# EAGLE design Akkucheck (EAGLE 5.11)
MF: AVAGO TECHNOLOGIES; MPN: ACPL-217-500E; OC_FARNELL: 1602614
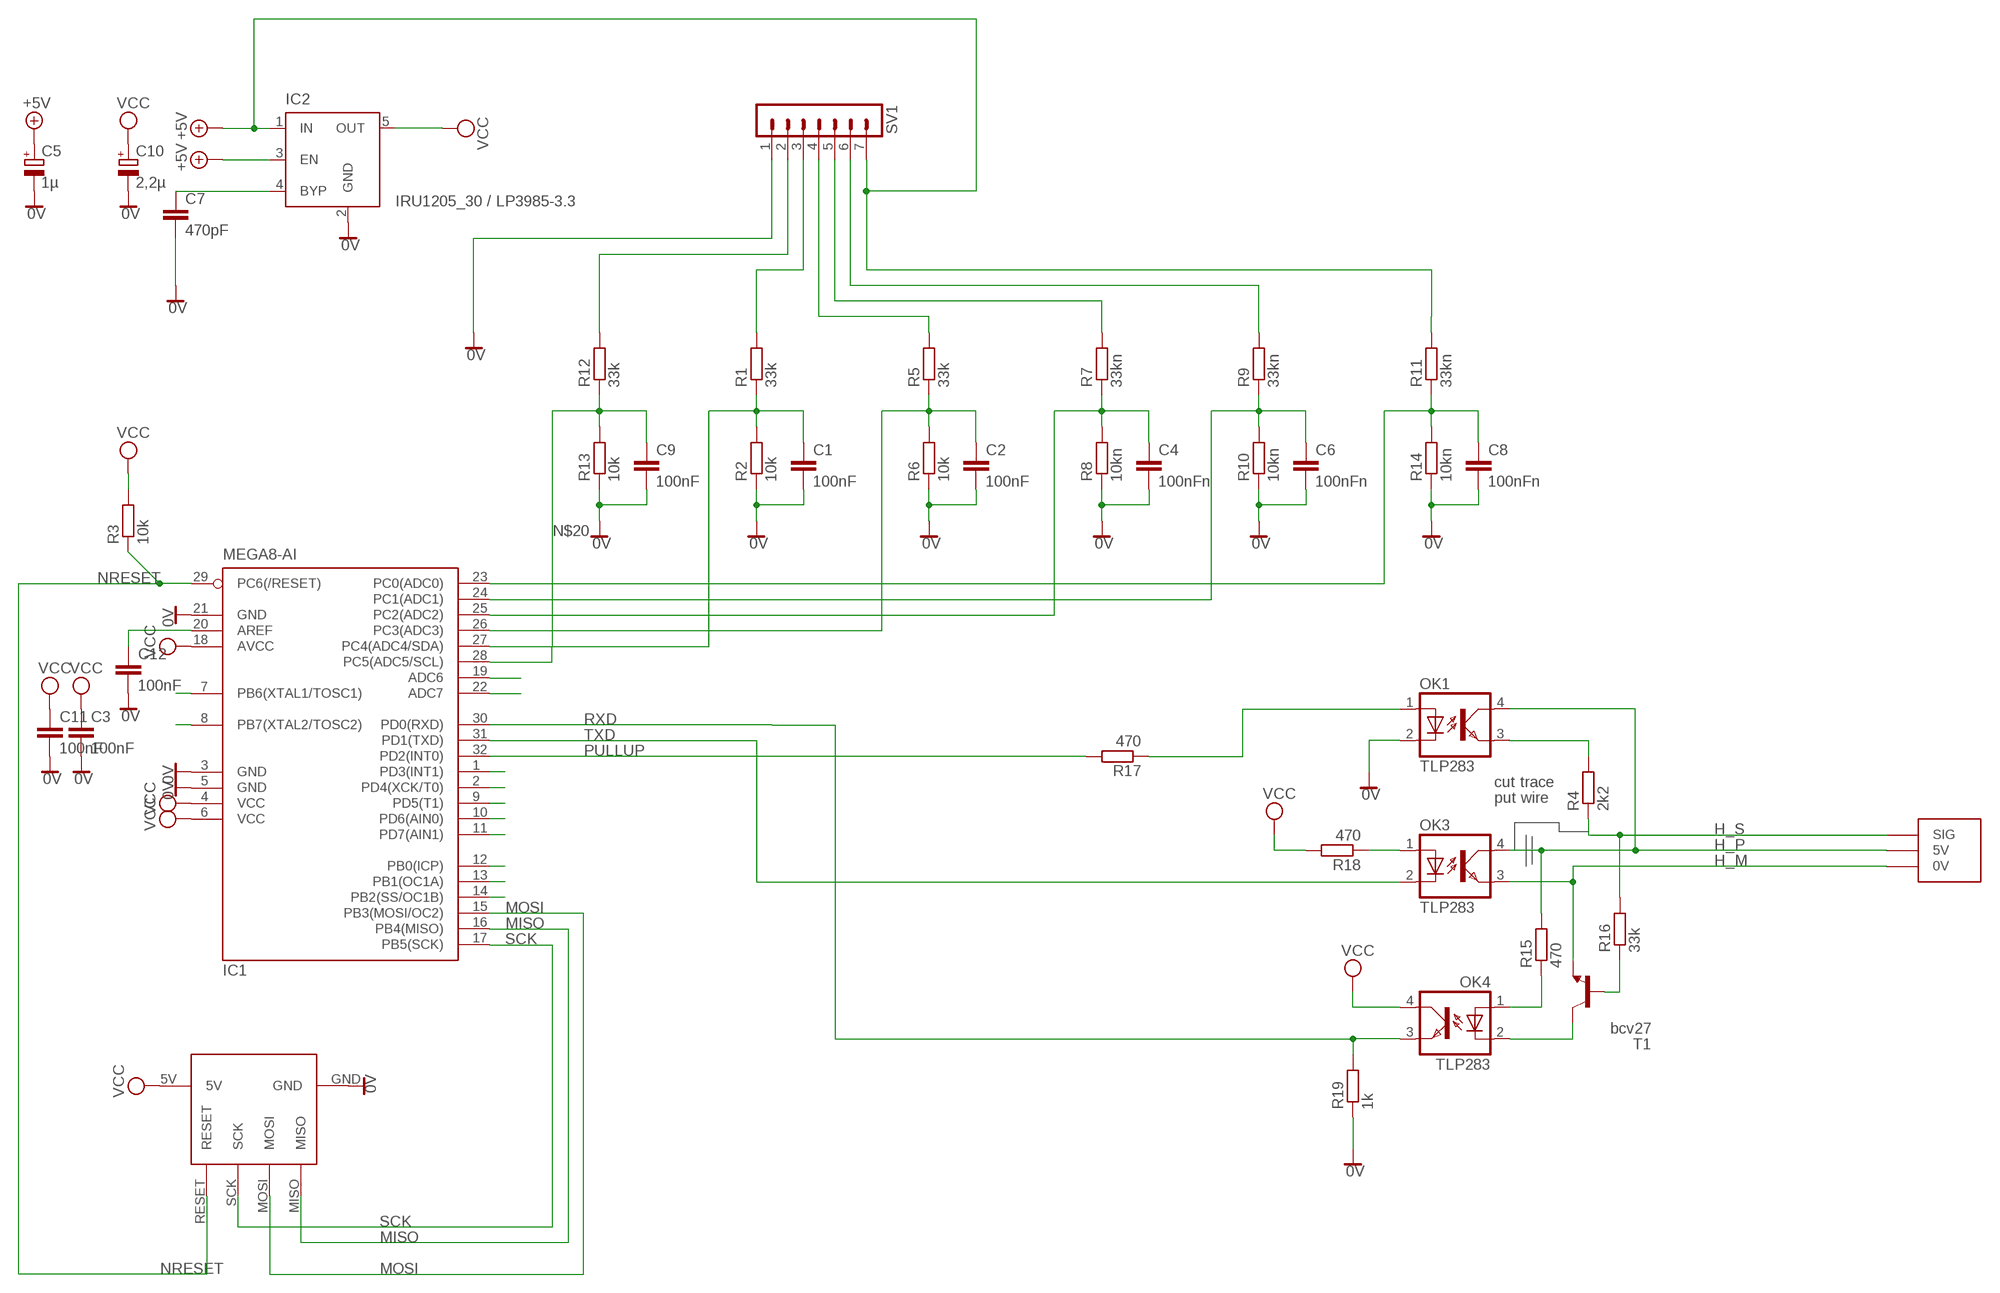
[diagram p0: schematic, sheet 1]

## Parts
C1  100nF  C-EUC0603  [C0603]
C2  100nF  C-EUC0603  [C0603]
C3  100nF  C-EUC0603  [C0603]
C4  100nFn  C-EUC0603  [C0603]
C5  1µ  CPOL-EUA/3216-18R  [A/3216-18R]
C6  100nFn  C-EUC0603  [C0603]
C7  470pF  C-EUC0805  [C0805]
C8  100nFn  C-EUC0603  [C0603]
C9  100nF  C-EUC0603  [C0603]
C10  2,2µ  CPOL-EUB/3528-21R  [B/3528-21R]
C11  100nF  C-EUC0603K  [C0603K]
C12  100nF  C-EUC0603  [C0603]
IC1  MEGA8-AI  [TQFP32-08]
IC2  IRU1205_30 / LP3985-3.3  MIC5219XX  [SOT23-5]
IN3  3-WIRE_CONNWIRE  [3WIRE_CONN]
OK1  TLP283  [MINI-FLAT-4]
OK3  TLP283  [MINI-FLAT-4]
OK4  TLP283  [MINI-FLAT-4]
R1  33k  R-EU_R0603  [R0603]
R2  10k  R-EU_R0603  [R0603]
R3  10k  R-EU_R0603  [R0603]
R4  2k2  R-EU_R0603  [R0603]
R5  33k  R-EU_R0603  [R0603]
R6  10k  R-EU_R0603  [R0603]
R7  33kn  R-EU_R0603  [R0603]
R8  10kn  R-EU_R0603  [R0603]
R9  33kn  R-EU_R0603  [R0603]
R10  10kn  R-EU_R0603  [R0603]
R11  33kn  R-EU_R0603  [R0603]
R12  33k  R-EU_R0603  [R0603]
R13  10k  R-EU_R0603  [R0603]
R14  10kn  R-EU_R0603  [R0603]
R15  470  R-EU_R0603  [R0603]
R16  33k  R-EU_R0603  [R0603]
R17  470  R-EU_R0603  [R0603]
R18  470  R-EU_R0603  [R0603]
R19  1k  R-EU_R0603  [R0603]
SV1  MA07-1  [MA07-1]
T1  bcv27  BC817-16-NPN-SOT23-BEC  [SOT23-BEC]
U$1  ISPSMD  [ISP_SMD]

## Nets
0V: C1.2 C2.2 C3.2 C4.2 C5.- C6.2 C7.2 C8.2 C9.2 C10.- C11.2 C12.2 IC1.3(GND) IC1.5(GND) IC1.21(GND) IC2.2(GND) OK1.2(C) R2.1 R6.1 R8.1 R10.1 R13.1 R14.1 R19.1 SV1.1 U$1.GND
+5V [supp]: C5.+ IC2.1(IN) IC2.3(EN) R11.2 SV1.7
H_M [isol]: IN3.0V OK3.3(EMIT) T1.E
H_P [isol]: IN3.5V OK1.4(COL) OK3.4(COL) R15.2
H_S [isol]: IN3.SIG R4.1 R16.2
MISO: IC1.16(PB4(MISO)) U$1.MISO
MOSI: IC1.15(PB3(MOSI/OC2)) U$1.MOSI
N$1 [supp]: R12.2 SV1.2
N$2 [supp]: R1.2 SV1.3
N$3 [supp]: R5.2 SV1.4
N$4 [supp]: R7.2 SV1.5
N$5 [supp]: R9.2 SV1.6
N$6: IC1.19(ADC6)
N$7: IC1.22(ADC7)
N$8: C7.1 IC2.4(BYP)
N$9: IC1.1(PD3(INT1))
N$10: IC1.2(PD4(XCK/T0))
N$11 [isol]: OK1.3(EMIT) R4.2
N$12 [isol]: OK4.1(A) R15.1
N$13 [isol]: OK4.2(C) T1.C
N$14: C8.1 IC1.23(PC0(ADC0)) R11.1 R14.2
N$15: C1.1 IC1.27(PC4(ADC4/SDA)) R1.1 R2.2
N$16: C2.1 IC1.26(PC3(ADC3)) R5.1 R6.2
N$17: C4.1 IC1.25(PC2(ADC2)) R7.1 R8.2
N$18: IC1.9(PD5(T1))
N$19: IC1.10(PD6(AIN0))
N$20: C9.1 IC1.28(PC5(ADC5/SCL)) R12.1 R13.2
N$21: C6.1 IC1.24(PC1(ADC1)) R9.1 R10.2
N$22 [isol]: R16.1 T1.B
N$23: OK3.1(A) R18.1
N$24: IC1.11(PD7(AIN1))
N$25: OK1.1(A) R17.1
N$26: C12.1 IC1.20(AREF)
N$27: IC1.12(PB0(ICP))
N$28: IC1.13(PB1(OC1A))
N$29: IC1.14(PB2(SS/OC1B))
N$30: IC1.7(PB6(XTAL1/TOSC1))
N$31: IC1.8(PB7(XTAL2/TOSC2))
NRESET: IC1.29(PC6(/RESET)) R3.1 U$1.RESET
PULLUP: IC1.32(PD2(INT0)) R17.2
RXD: IC1.30(PD0(RXD)) OK4.3(EMIT) R19.2
SCK: IC1.17(PB5(SCK)) U$1.SCK
TXD: IC1.31(PD1(TXD)) OK3.2(C)
VCC: C3.1 C10.+ C11.1 IC1.4(VCC) IC1.6(VCC) IC1.18(AVCC) IC2.5(OUT) OK4.4(COL) R3.2 R18.2 U$1.5V

## Notes on the sheet
- cut trace
- put wire

## Library data of the parts
C1-C4 C6-C9 C11 C12 = rcl:C-EU: CAPACITOR, European symbol
C5 C10 = rcl:CPOL-EU: POLARIZED CAPACITOR, European symbol
IC1 = atmel:MEGA8: MICROCONTROLLER 8 Kbytes FLASH, 1 kbytes SRAM, 512 bytes EEPROM, USART, 6-channel 10 bit ADC, 2-channel 8 bit ADC Pin compatible with Atmega48, ATMega88, ATMega168 Source: avr.lbr; MPN: ATMEGA8-16AU; OC_FARNELL: 9171371; OC_NEWARK: 73M8863
IC2 = v-reg-micrel:MIC5219XX: VOLTAGE REGULATOR; OC_FARNELL: unknown; OC_NEWARK: unknown
IN3 = Fabi:3-WIRE_CONN
OK1 OK3 OK4 = optocoupler:TLP283: TOSHIBA PHOTOCOUPLER GaAs IRED & PHOTO-TRANSISTOR Source: http://www.semicon.toshiba.co.jp/td/en/Opto/Photocoupler/en_20050928_TLP283_datasheet.pdf; OC_FARNELL: unknown; OC_NEWARK: unknown
R1-R19 = rcl:R-EU_: RESISTOR, European symbol
SV1 = con-lstb:MA07-1: PIN HEADER; OC_FARNELL: unknown; OC_NEWARK: unknown
T1 = transistor:*-NPN-: NPN Transistror BF959 corrected 2008.03.06
U$1 = Fabi:ISP: ISP connector

## Net classes
0 default: width 0.15 mm
1 supp: width 0.25 mm
2 isol: width 0.15 mm, clearance 0.5 mm to class 0, clearance 0.5 mm to class 1

## Board
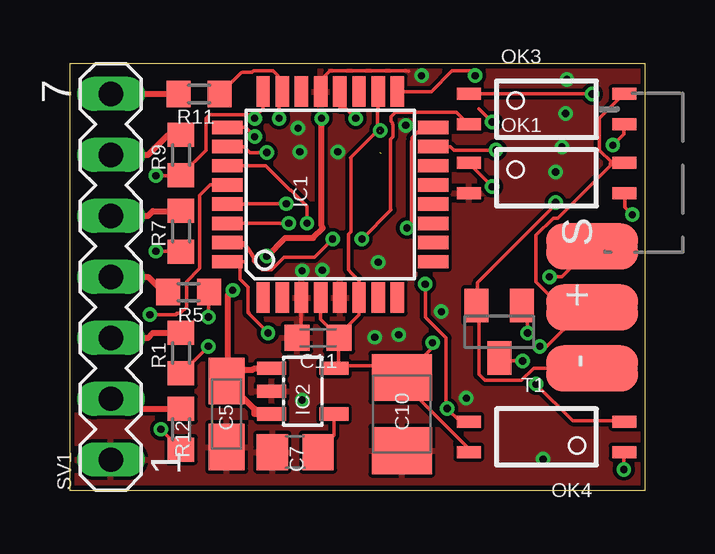
[diagram p1: board, top side]
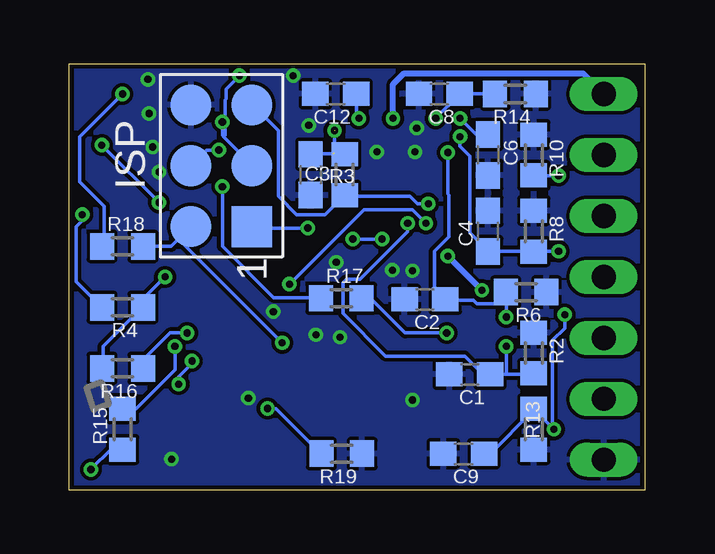
[diagram p2: board, bottom side, seen from below]

Size 24 x 17.78 mm. Coordinates in mm from the lower left corner, seen from the top.
Outline: 0,0 24,0 24,17.78 0,17.78 0,0
Copper layers (1*16): Top 0.035mm / dielectric 1.5mm / Bottom 0.035mm
Design rules "Fischer-LP": minimum track width 0.15mm, minimum drill 0.3mm, track to track 0.15mm, track to pad 0.15mm, pad to pad 0.15mm, via to via 0.15mm, smd to smd 0mil, copper to edge 0.2mm, drill to drill 0.3mm, minimum pad ring 0.2mm, minimum via ring 0.15mm, stop-mask expansion 0.15mm, vias tented up to drill 0.5mm, thermal gap 0.15mm
vRestrict: area 22.4,3.5 to 24.3,5.4

### Footprints (pad centres in the part's own frame; a part is rotated, then mirrored left to right if it is on the bottom)
C0603 = smd 1.1 x 1: 1 -0.85,0; 2 0.85,0
A/3216-18R = smd 1.95 x 1.5: + 1.375,0; - -1.375,0
C0805 = smd 1.3 x 1.5: 1 -0.95,0; 2 0.95,0
B/3528-21R = smd 1.95 x 2.5: + 1.525,0; - -1.525,0
C0603K = smd 1.05 x 1.08: 1 -0.875,0; 2 0.875,0
TQFP32-08 = smd 1.27 x 0.559: 1 -4.293,2.8; 2 -4.293,2; 3 -4.293,1.2; 4 -4.293,0.4; 5 -4.293,-0.4; 6 -4.293,-1.2; 7 -4.293,-2; 8 -4.293,-2.8; 17 4.293,-2.8; 18 4.293,-2; 19 4.293,-1.2; 20 4.293,-0.4; 21 4.293,0.4; 22 4.293,1.2; 23 4.293,2; 24 4.293,2.8 | smd 0.559 x 1.27: 9 -2.8,-4.293; 10 -2,-4.293; 11 -1.2,-4.293; 12 -0.4,-4.293; 13 0.4,-4.293; 14 1.2,-4.293; 15 2,-4.293; 16 2.8,-4.293; 25 2.8,4.293; 26 2,4.293; 27 1.2,4.293; 28 0.4,4.293; 29 -0.4,4.293; 30 -1.2,4.293; 31 -2,4.293; 32 -2.8,4.293
SOT23-5 = smd 0.55 x 1.2: 1 -0.95,-1.3; 2 0,-1.3; 3 0.95,-1.3; 4 0.95,1.3; 5 -0.95,1.3
3WIRE_CONN = smd 1.905 x 3.81: 0V -2.54,0; 5V 0,0; SIG 2.54,0
MINI-FLAT-4 = smd 1 x 0.5: 1 -3.24,0.635; 2 -3.24,-0.635; 3 3.24,-0.635; 4 3.24,0.635
R0603 = smd 1 x 1.1: 1 -0.85,0; 2 0.85,0
MA07-1 = drill 1.016 long: 1 -7.62,0; 2 -5.08,0; 3 -2.54,0; 4 0,0; 5 2.54,0; 6 5.08,0; 7 7.62,0
SOT23-BEC = smd 1 x 1.4: B -0.95,-1.1; C 0,1.1; E 0.95,-1.1
ISP_SMD = smd 1.7 x 1.7: 5V -2.54,1.27; GND 2.54,1.27; MISO -2.54,-1.27; MOSI 0,1.27; RESET 2.54,-1.27; SCK 0,-1.27

### Placement (x,y rotation side)
C1  7.3,4.83 180 bottom
C2  9.17,7.95 180 bottom
C3  13.94,13.15 270 bottom
C4  6.54,10.79 90 bottom
C5  6.54,3.17 90 top
C6  6.54,13.97 270 bottom
C7  9.4,1.59 180 top
C8  8.57,16.51 180 bottom
C9  7.56,1.52 180 bottom
C10  13.84,3.17 90 top
C11  10.35,6.35 180 top
C12  12.89,16.51 180 bottom
IC1  10.86,12.32 90 top
IC2  9.72,4.13 270 top
IN3  21.78,7.62 90 top
OK1  19.88,13.02 0 top
OK3  19.88,15.88 0 top
OK4  19.88,2.22 180 top
R1  4.64,5.71 90 top
R2  4.64,5.71 270 bottom
R3  12.52,13.15 90 bottom
R4  21.78,7.62 180 bottom
R5  4.95,8.26 180 top
R6  4.95,8.26 180 bottom
R7  4.64,10.79 90 top
R8  4.64,10.79 270 bottom
R9  4.64,13.97 90 top
R10  4.64,13.97 270 bottom
R11  5.4,16.51 180 top
R12  4.64,2.54 90 top
R13  4.64,2.54 90 bottom
R14  5.4,16.51 180 bottom
R15  21.78,2.54 90 bottom
R16  21.78,5.08 180 bottom
R17  12.66,8 0 bottom
R18  21.78,10.16 0 bottom
R19  12.64,1.52 180 bottom
SV1  1.71,8.89 90 top
T1  17.91,6.6 180 top
U$1  17.66,13.52 90 bottom

### Tracks (layer width: path | path; a pad name or v marks a point on that pad's centre or on a via)
0V  (via drill 0.3, 0.3 pad 0.6)
  Top 0.15: 10.5,16.61 10.5,17.12 10.86,17.48 14.01,17.48 14.12,17.45 | C11.2 9.64,6.58 9.64,6.99 9.64,7.82 9.66,7.85 9.66,7.92 IC1.3
  other vias: 14.01,15.2 13.72,6.48 9.59,14.1 11.18,14.1 9.69,9.14 9.69,3.76 14.67,17.27 12.71,6.38 12.87,9.5 10.53,9.17 9.51,15.09 20.26,13.26 15.49,7.44 16.54,3.84 20.68,15.7 20.52,14.3 20.73,17.12 19.74,1.3
  pour Bottom: 24,0 0.02,0 0.02,17.78 24,17.78
  pour Top: -0.05,17.78 24,17.78 24,0 -0.05,0
+5V  (via drill 0.3 pad 0.6)
  Top 0.25: IC2.3 7.69,3.18 7.69,3.4 C5.+ | IC2.1 7.69,5.08 7.64,5.03 6.69,5.03 C5.+ | C5.+ 6.59,4.84 6.59,8.13 v6.79,8.33 | v8.22,9.75 8.98,10.52 10,10.52 10.1,10.52 10.15,10.52 10.55,10.92 10.5,11.02 v10.5,15.49 | SV1.7 R11.2
  Bottom 0.25: v10.5,15.49 10.5,16.92 10.05,17.37 2.58,17.37 SV1.7 | v6.79,8.33 v8.22,9.75
H_M  (via drill 0.3 pad 0.6)
  Top 0.15: IN3.0V 19.34,5.08 18.83,4.57 17.31,4.57 17.06,4.83 17.06,7.67 T1.E 17.01,7.72 17.01,8.64 20.26,11.89 v20.26,11.99 | v22.64,14.38 23.1,14.83 OK3.3
  Bottom 0.15: v20.26,11.99 v22.64,14.38
H_P  (via drill 0.3 pad 0.6)
  Top 0.15: 21.2,7.29 20.97,7.16 19.44,8.69 19.44,10.62 20.15,11.33 20.36,11.33 22.54,13.51 22.54,13.61 22.59,13.66 | 21.2,7.29 IN3.5V | v19.6,5.99 19.9,5.99 21.2,7.29 | 22.59,13.66 22.09,14.17 22.09,15.49 OK3.4 | 22.59,13.66 23.1,13.66 OK1.4
  Bottom 0.15: v19.6,5.99 19.6,5.03 21.22,3.4 21.78,3.4 R15.2
H_S  (via drill 0.3 pad 0.6)
  Top 0.15: v20,8.89 20.51,8.89 IN3.SIG
  Bottom 0.15: v20,8.89 20.92,7.98 20.92,7.67 R4.1 20.97,7.62 22.59,5.99 22.59,5.08 R16.2
MISO  (via drill 0.3 pad 0.6)
  Top 0.15: 14.96,15.09 IC1.16 14.62,15.04 14.26,14.68 14.26,14.58 14.24,14.54 14.24,11.1 v14.06,10.92 | 14.96,15.09 14.75,15.05 | 14.96,15.09 14.67,15.09
  Bottom 0.15: v14.06,10.92 16.29,10.92 16.34,10.97 U$1.MISO
MOSI  (via drill 0.3 pad 0.6)
  Top 0.15: IC1.15 15.86,14.32 16.01,14.17 v17.77,14.17
  Bottom 0.15: v17.77,14.17 18.28,14.17 U$1.MOSI
N$1
  Top 0.25: SV1.2 2.12,3.4 4.61,3.4 R12.2
N$2
  Top 0.25: SV1.3 3.26,6.35 3.46,6.55 4.61,6.55 R1.2
N$3
  Top 0.25: SV1.4 3.26,8.89 3.87,8.28 4.1,8.28 R5.2
N$4
  Top 0.25: SV1.5 3.26,11.43 3.46,11.63 4.61,11.63 R7.2
N$5
  Top 0.25: SV1.6 3.26,13.97 4.07,14.78 4.61,14.78 R9.2
N$8
  Top 0.15: C7.1 10.35,1.63 11.01,2.29 11.01,3.15 IC2.4
N$11  (via drill 0.3 pad 0.6)
  Top 0.15: v23.46,11.48 23.15,11.79 23.15,12.34 OK1.3
  Bottom 0.15: R4.2 22.64,7.62 23.71,8.69 23.71,10.97 23.46,11.23 v23.46,11.48
N$12  (via drill 0.3 pad 0.6)
  Top 0.15: v23.1,0.86 23.1,1.57 OK4.1
  Bottom 0.15: R15.1 21.78,1.73 22.24,1.73 v23.1,0.86
N$13  (via drill 0.3 pad 0.6)
  Top 0.15: T1.C 17.92,5.49 18.02,5.38 v18.88,5.38 | v19.44,4.42 20.97,2.9 23.1,2.9 OK4.2
  Bottom 0.15: v18.88,5.38 18.88,5.28 19.44,4.72 v19.44,4.42
N$14  (via drill 0.3 pad 0.6)
  Top 0.15: R11.1 7.14,17.4 7.2,17.42 7.61,17.42 7.66,17.48 8.47,17.48 8.67,17.27 8.67,17.12 IC1.23 8.83,16.73 8.83,16.98 8.72,17.08 v8.72,15.49
  Bottom 0.15: v8.72,15.49 7.76,16.46 C8.1 R11.1
N$15  (via drill 0.3 pad 0.6)
  Top 0.15: IC1.27 7.28,13.52 8.1,13.52 8.17,13.51 9.18,12.5 9.23,12.5 9.89,11.84 9.89,11.79 9.89,11.72 v9.89,11.12 | R1.1 4.66,4.88 v5.78,5.99
  Bottom 0.15: v5.78,5.99 5.78,4.83 | v9.89,11.12 9.89,10.77 11.87,8.79 12.43,8.79 12.59,8.64 12.59,7.37 10.81,5.59 7.51,5.59 6.64,4.72 C1.1 5.78,4.83 | 5.78,4.83 4.66,4.83 R1.1
N$16  (via drill 0.3 pad 0.6)
  Top 0.15: IC1.26 7.28,14.32 7.53,14.07 v8.22,14.07 | v5.78,7.21 5.78,8.23 R5.1
  Bottom 0.15: v8.22,14.07 8.22,12.34 8.17,12.29 8.17,10.57 8.78,9.96 8.78,8.48 8.32,8.03 C2.1 8.32,7.92 7.15,7.92 7,7.77 5.83,7.77 R5.1 5.78,8.23 v5.78,7.21
N$17  (via drill 0.3 pad 0.6)
  Top 0.15: IC1.25 7.28,15.12 7.32,15.12 v7.71,14.73 | R7.1 4.61,9.96 v3.59,9.96
  Bottom 0.15: v7.71,14.73 7.71,14.33 7.3,13.92 7.3,10.72 6.59,10.01 C4.1 4.66,9.96 R7.1 4.61,9.96 v3.59,9.96
N$20  (via drill 0.3 pad 0.6)
  Top 0.15: IC1.28 5.85,12.72 5.42,12.29 5.42,9.25 4.86,8.69 4.86,7.75 4.86,7.72 4.86,7.62 4.61,7.37 4.46,7.37 4.43,7.32 v3.34,7.32 | R12.1 4.61,1.73 v3.8,2.54
  Bottom 0.15: v3.34,7.32 3.34,6.76 3.85,6.25 3.85,2.69 v3.8,2.54 4.61,3.35 R13.2 4.66,3.3 6.44,1.52 C9.1
N$21  (via drill 0.3 pad 0.6)
  Top 0.15: IC1.24 8.06,15.9 7.71,15.55 v7.71,15.49 | v7.71,15.49 7.69,15.55 | v3.59,13.11 4.61,13.11 R9.1 4.66,13.16 5.68,14.17 5.68,15.37 5.68,15.44 5.68,15.49 5.83,15.65 7.71,15.65 v7.71,15.49
  Bottom 0.15: v7.71,15.49 7.05,14.83 6.54,14.83 C6.1 | v3.59,13.11 4.61,13.11 R9.1
N$22  (via drill 0.3 pad 0.6)
  Top 0.15: v19.09,6.55 19.09,7.47 18.88,7.67 T1.B
  Bottom 0.15: v19.09,6.55 19.8,6.55 20.92,5.44 20.92,5.08 R16.1
N$23  (via drill 0.3 pad 0.6)
  Top 0.15: OK3.1 v21.78,16.51
  Bottom 0.15: v21.78,16.51 23.56,14.73 23.56,12.85 22.54,11.84 22.54,10.21 22.59,10.16 R18.1
N$25  (via drill 0.3 pad 0.6)
  Top 0.15: v17.61,12.65 16.65,13.61 OK1.1
  Bottom 0.15: R17.1 13.55,8.03 15.48,8.03 17.61,10.16 v17.61,12.65
N$26  (via drill 0.3 pad 0.6)
  Top 0.15: IC1.20 11.26,15.9 11.52,15.9 v11.93,15.49
  Bottom 0.15: C12.1 12.03,16.51 12.03,15.6 v11.93,15.49
NRESET  (via drill 0.3 pad 0.6)
  Top 0.15: IC1.29 7.28,11.92 7.3,11.94 v9.03,11.94
  Bottom 0.15: v9.03,11.94 9.49,11.94 9.79,12.24 12.48,12.24 R3.1 12.53,12.29 13.35,11.48 14.52,11.48 15.28,12.24 15.28,14.99 16.34,16.05 U$1.RESET
PULLUP  (via drill 0.3 pad 0.6)
  Top 0.15: 7.28,9.52 IC1.32 7.1,9.45 7.1,8.79 7.43,8.46 7.43,7.39 | 7.43,7.39 7.48,7.39 | 7.43,7.39 v8.27,6.55
  Bottom 0.15: v8.27,6.55 9.99,6.55 11.42,7.98 11.77,7.98 R17.2
RXD  (via drill 0.3 pad 0.6)
  Top 0.15: IC1.30 7.28,11.12 v9.13,11.12 | v14.82,8.59 14.82,7.21 15.68,6.35 15.68,3.45 v15.74,3.4 16.24,2.9 16.6,2.9 OK4.3
  Bottom 0.15: v14.82,8.59 11.72,11.68 9.69,11.68 v9.13,11.12 | R19.2 15.38,3.4 v15.74,3.4
SCK  (via drill 0.3, 0.3 pad 0.6)
  Top 0.15: v17.61,15.34 17.06,15.9 | v16.9,17.27 16.7,17.48 15.94,17.48 15.07,16.61 13.7,16.61 IC1.17
  Bottom 0.15: U$1.SCK 16.4,13.56 17.56,14.73 | 17.56,14.73 17.61,14.78 v17.61,15.34 | v16.9,17.27 17.46,16.71 17.46,16.31 17.51,16.26 17.51,14.78 17.56,14.73
TXD  (via drill 0.3 pad 0.6)
  Top 0.15: OK3.2 16.16,15.71 16.12,15.75 13.58,15.75 13.4,15.57 13.4,15.37 13.45,15.32 13.45,15.27 13.47,15.21 13.47,14.73 13.37,14.63 13.37,11.73 13.4,11.68 v12.18,10.46 | IC1.31 7.28,10.32 7.38,10.13 | v10.96,10.46 10.2,9.7 8.93,9.7 8.42,9.2 8.01,9.2 7.66,9.55 7.66,9.7 7.4,10.11 7.38,10.13 | 7.38,10.13 7.2,10.22
  Bottom 0.15: v10.96,10.46 v12.18,10.46
VCC  (via drill 0.3 pad 0.6)  (2 unrouted)
  Top 0.15: 12.84,14.99 12.92,14.99 | IC1.4 10.46,7.31 10.46,7.12 C11.1 | IC1.18 12.86,15.9 12.84,15.88 12.84,14.99 | 11.09,5.11 11.26,5.18 14.26,5.18 C10.+ | IC2.5 11.09,5.11 | 11.09,5.11 11.21,5.23 11.21,6.34 C11.1 | C10.+ 13.91,4.72 15.13,5.94 v15.13,6.15 | C10.+ 13.86,4.67 13.86,4.52 16.6,1.78 16.6,1.63 OK4.4 | 12.84,14.99 11.71,13.86 11.72,13.82 11.72,10.77 11.62,10.67 11.62,9.2 11.67,9.14 11.71,9.09 12.06,8.74 IC1.6 12.06,7.31 11.18,6.43 C11.1
  Bottom 0.15: v12.94,14.99 12.94,14.07 12.71,14.03 | v15.13,6.15 19.39,10.41 U$1.5V 19.75,10.16 R18.2 | C3.1 13.91,14.02 12.99,14.02 R3.2

### Text on the board
tDocu: cut trace | put wire | add 7805 voltage regulator here
bDocu: add 47k resistor